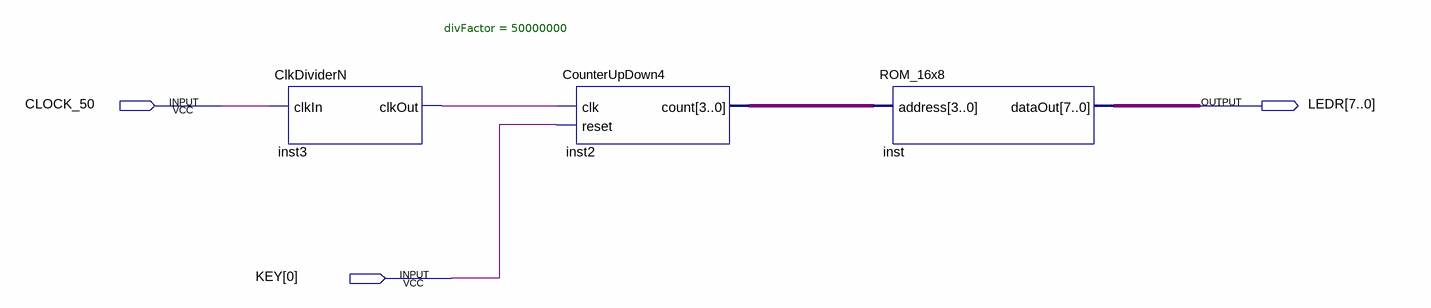
[diagram p0: schematic sheet]
// Quartus schematic ROM_Demo.bdf as structural Verilog: 3 symbols, 3 pins
module ROM_Demo (
  input  CLOCK_50,
  input  [0:0] KEY,
  output [7:0] LEDR
);

  wire inst3_clkout;
  wire [3:0] inst2_count;

  ClkDividerN #(.divFactor(50000000)) inst3 (.clkIn(CLOCK_50), .clkOut(inst3_clkout));
  CounterUpDown4 inst2 (.clk(inst3_clkout), .reset(KEY[0]), .count(inst2_count));
  ROM_16x8 inst (.address(inst2_count), .dataOut(LEDR));
endmodule
